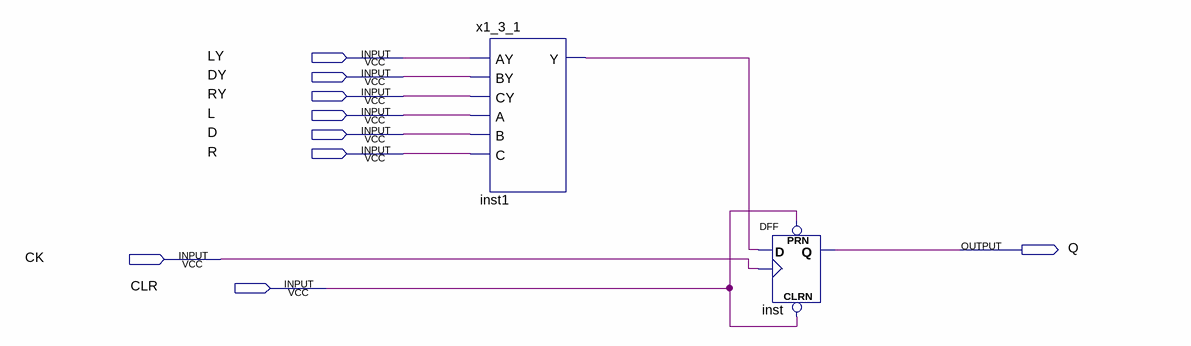
[diagram p0: schematic sheet]
// Quartus schematic move1.bdf as structural Verilog: 2 symbols, 9 pins
module move1 (
  input  LY,
  input  DY,
  input  RY,
  input  L,
  input  D,
  input  R,
  input  CK,
  input  CLR,
  output Q
);

  wire inst1_y;

  x1_3_1 inst1 (.AY(LY), .BY(DY), .CY(RY), .A(L), .B(D), .C(R), .Y(inst1_y));
  DFF inst (.CLRN(CLR), .CLK(CK), .D(inst1_y), .PRN(CLR), .Q(Q));
endmodule
